# EAGLE schematic r3eflow-v1-outdated (EAGLE 9.3.0)

## Sheet 1 of 4: Main MCU
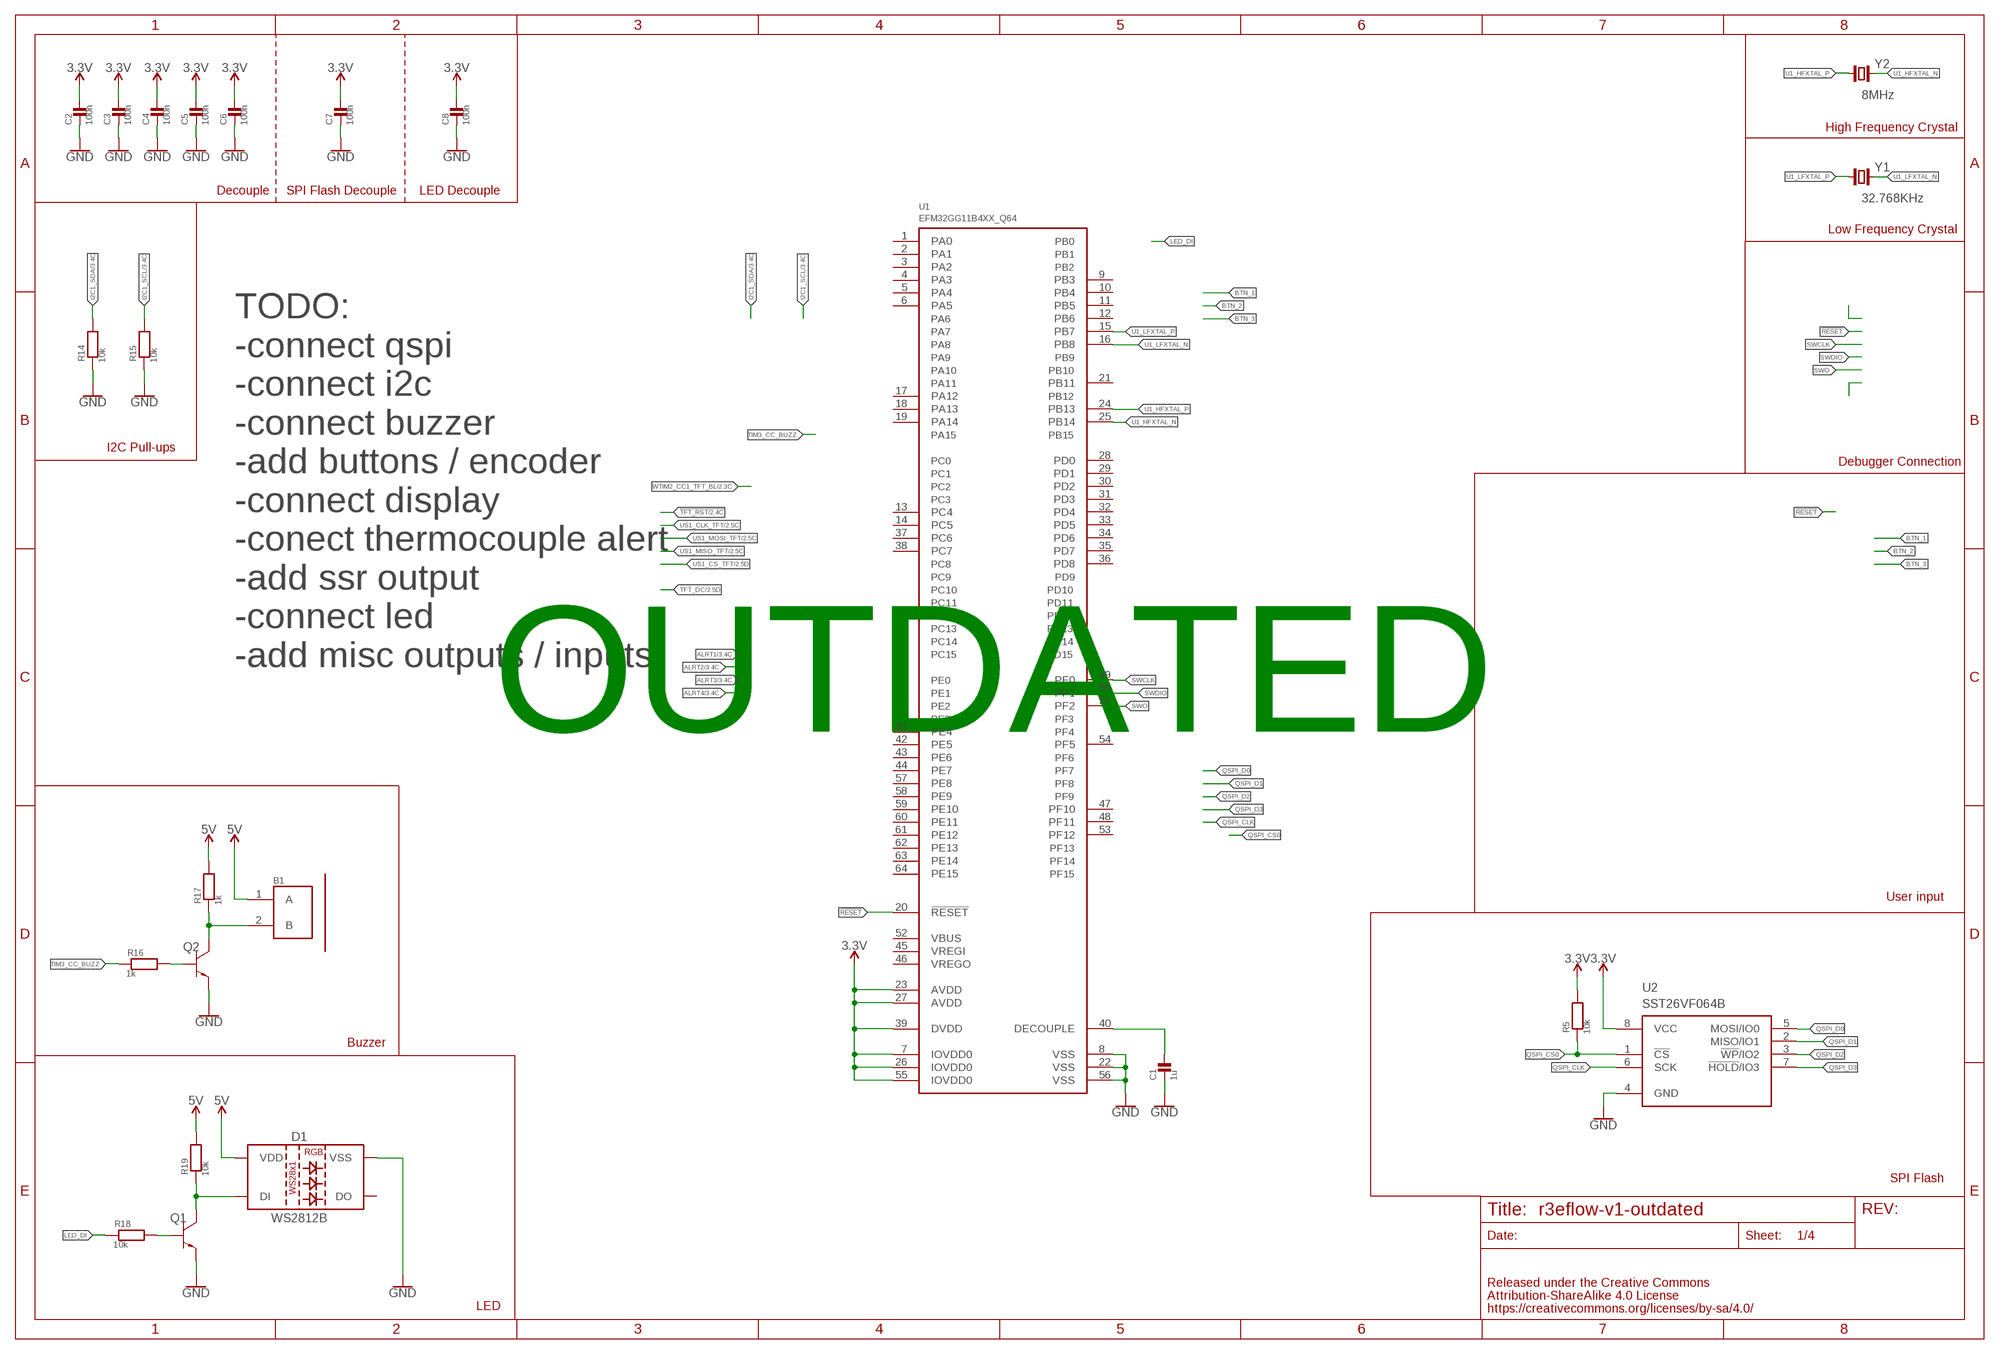
[diagram p0: schematic, sheet 1]

### Parts
B1  PKLCS1212E2400-R1  [BUZZ_PIEZO_SMD]
C1  1u  CAPACITOR_C0603  [0603_WAVE]
C2  100n  CAPACITOR_C0603  [0603_WAVE]
C3  100n  CAPACITOR_C0603  [0603_WAVE]
C4  100n  CAPACITOR_C0603  [0603_WAVE]
C5  100n  CAPACITOR_C0603  [0603_WAVE]
C6  100n  CAPACITOR_C0603  [0603_WAVE]
C7  100n  CAPACITOR_C0603  [0603_WAVE]
C8  100n  CAPACITOR_C0603  [0603_WAVE]
D1  WS2812B  [WS2812B]
Q1  BC817-40  [SOT-23-3]
Q2  BC817-40  [SOT-23-3]
R5  10k  RESISTOR0603  [0603_WAVE]
R14  10k  RESISTOR0603  [0603_WAVE]
R15  10k  RESISTOR0603  [0603_WAVE]
R16  1k  RESISTOR0603  [0603_WAVE]
R17  1k  RESISTOR0603  [0603_WAVE]
R18  10k  RESISTOR0603  [0603_WAVE]
R19  10k  RESISTOR0603  [0603_WAVE]
U1  EFM32GG11B4XX_Q64  [QFP64]
U2  SST26VF064B  [WSOIC8]
Y1  32.768KHz  CRYSTALCM200S  [CM200S]
Y2  8MHz  CRYSTALNX5032GA  [2-SMD-5X3]

### Nets
3.3V: C2.P$1 C3.P$1 C4.P$1 C5.P$1 C6.P$1 C7.P$1 C8.P$1 R5.P$2 U1.7(IOVDD0) U1.23(AVDD) U1.26(IOVDD0) U1.27(AVDD) U1.39(DVDD) U1.55(IOVDD0) U2.8(VCC) ; also sheet 2,3,4
5V: B1.1(A) D1.1(VDD) R17.P$2 R19.P$2 ; also sheet 2,4
!RESET: U1.20(!RESET)
GND: C1.P$2 C2.P$2 C3.P$2 C4.P$2 C5.P$2 C6.P$2 C7.P$2 C8.P$2 D1.3(VSS) Q1.P$2(EM2) Q2.P$2(EM2) R14.P$1 R15.P$1 U1.8(VSS) U1.22(VSS) U1.56(VSS) U2.4(GND) ; also sheet 2,3,4
I2C1_SCL: R15.P$2 ; also sheet 3
I2C1_SDA: R14.P$2 ; also sheet 3
LED_DI: R18.P$1
N$1: D1.4(DI) Q1.P$3(C03) R19.P$1
N$2: Q1.P$1(BA1) R18.P$2
N$3: C1.P$1 U1.40(DECOUPLE)
N$4: B1.2(B) Q2.P$3(C03) R17.P$1
N$5: Q2.P$1(BA1) R16.P$2
QSPI_CLK: U2.6(SCK)
QSPI_CS0: R5.P$1 U2.1(!CS!)
QSPI_D0: U2.5(MOSI/IO0)
QSPI_D1: U2.2(MISO/IO1)
QSPI_D2: U2.3(!WP!/IO2)
QSPI_D3: U2.7(!HOLD!/IO3)
SWCLK: U1.49(PF0)
SWDIO: U1.50(PF1)
SWO: U1.51(PF2)
TIM3_CC_BUZZ: R16.P$1
U1_HFXTAL_N: U1.25(PB14) Y2.2
U1_HFXTAL_P: U1.24(PB13) Y2.1
U1_LFXTAL_N: U1.16(PB8) Y1.4
U1_LFXTAL_P: U1.15(PB7) Y1.1
Unconnected: D1.2(DO) U1.1(PA0) U1.2(PA1) U1.3(PA2) U1.4(PA3) U1.5(PA4) U1.6(PA5) U1.9(PB3) U1.10(PB4) U1.11(PB5) U1.12(PB6) U1.13(PC4) U1.14(PC5) U1.17(PA12) U1.18(PA13) U1.19(PA14) U1.21(PB11) U1.28(PD0) U1.29(PD1) U1.30(PD2) U1.31(PD3) U1.32(PD4) U1.33(PD5) U1.34(PD6) U1.35(PD7) U1.36(PD8) U1.37(PC6) U1.38(PC7) U1.41(PE4) U1.42(PE5) U1.43(PE6) U1.44(PE7) U1.45(VREGI) U1.46(VREGO) U1.47(PF10) U1.48(PF11) U1.52(VBUS) U1.53(PF12) U1.54(PF5) U1.57(PE8) U1.58(PE9) U1.59(PE10) U1.60(PE11) U1.61(PE12) U1.62(PE13) U1.63(PE14) U1.64(PE15)

### Notes on the sheet
- High Frequency Crystal
- Decouple | SPI Flash Decouple | LED Decouple
- Low Frequency Crystal
- TODO:
  -connect qspi
  -connect i2c
  -connect buzzer
  -add buttons / encoder
  -connect display
  -conect thermocouple alert
  -add ssr output
  -connect led
  -add misc outputs / inputs
- I2C Pull-ups
- Debugger Connection
- OUTDATED
- User input
- Buzzer
- SPI Flash
- LED

## Sheet 2 of 4: Display
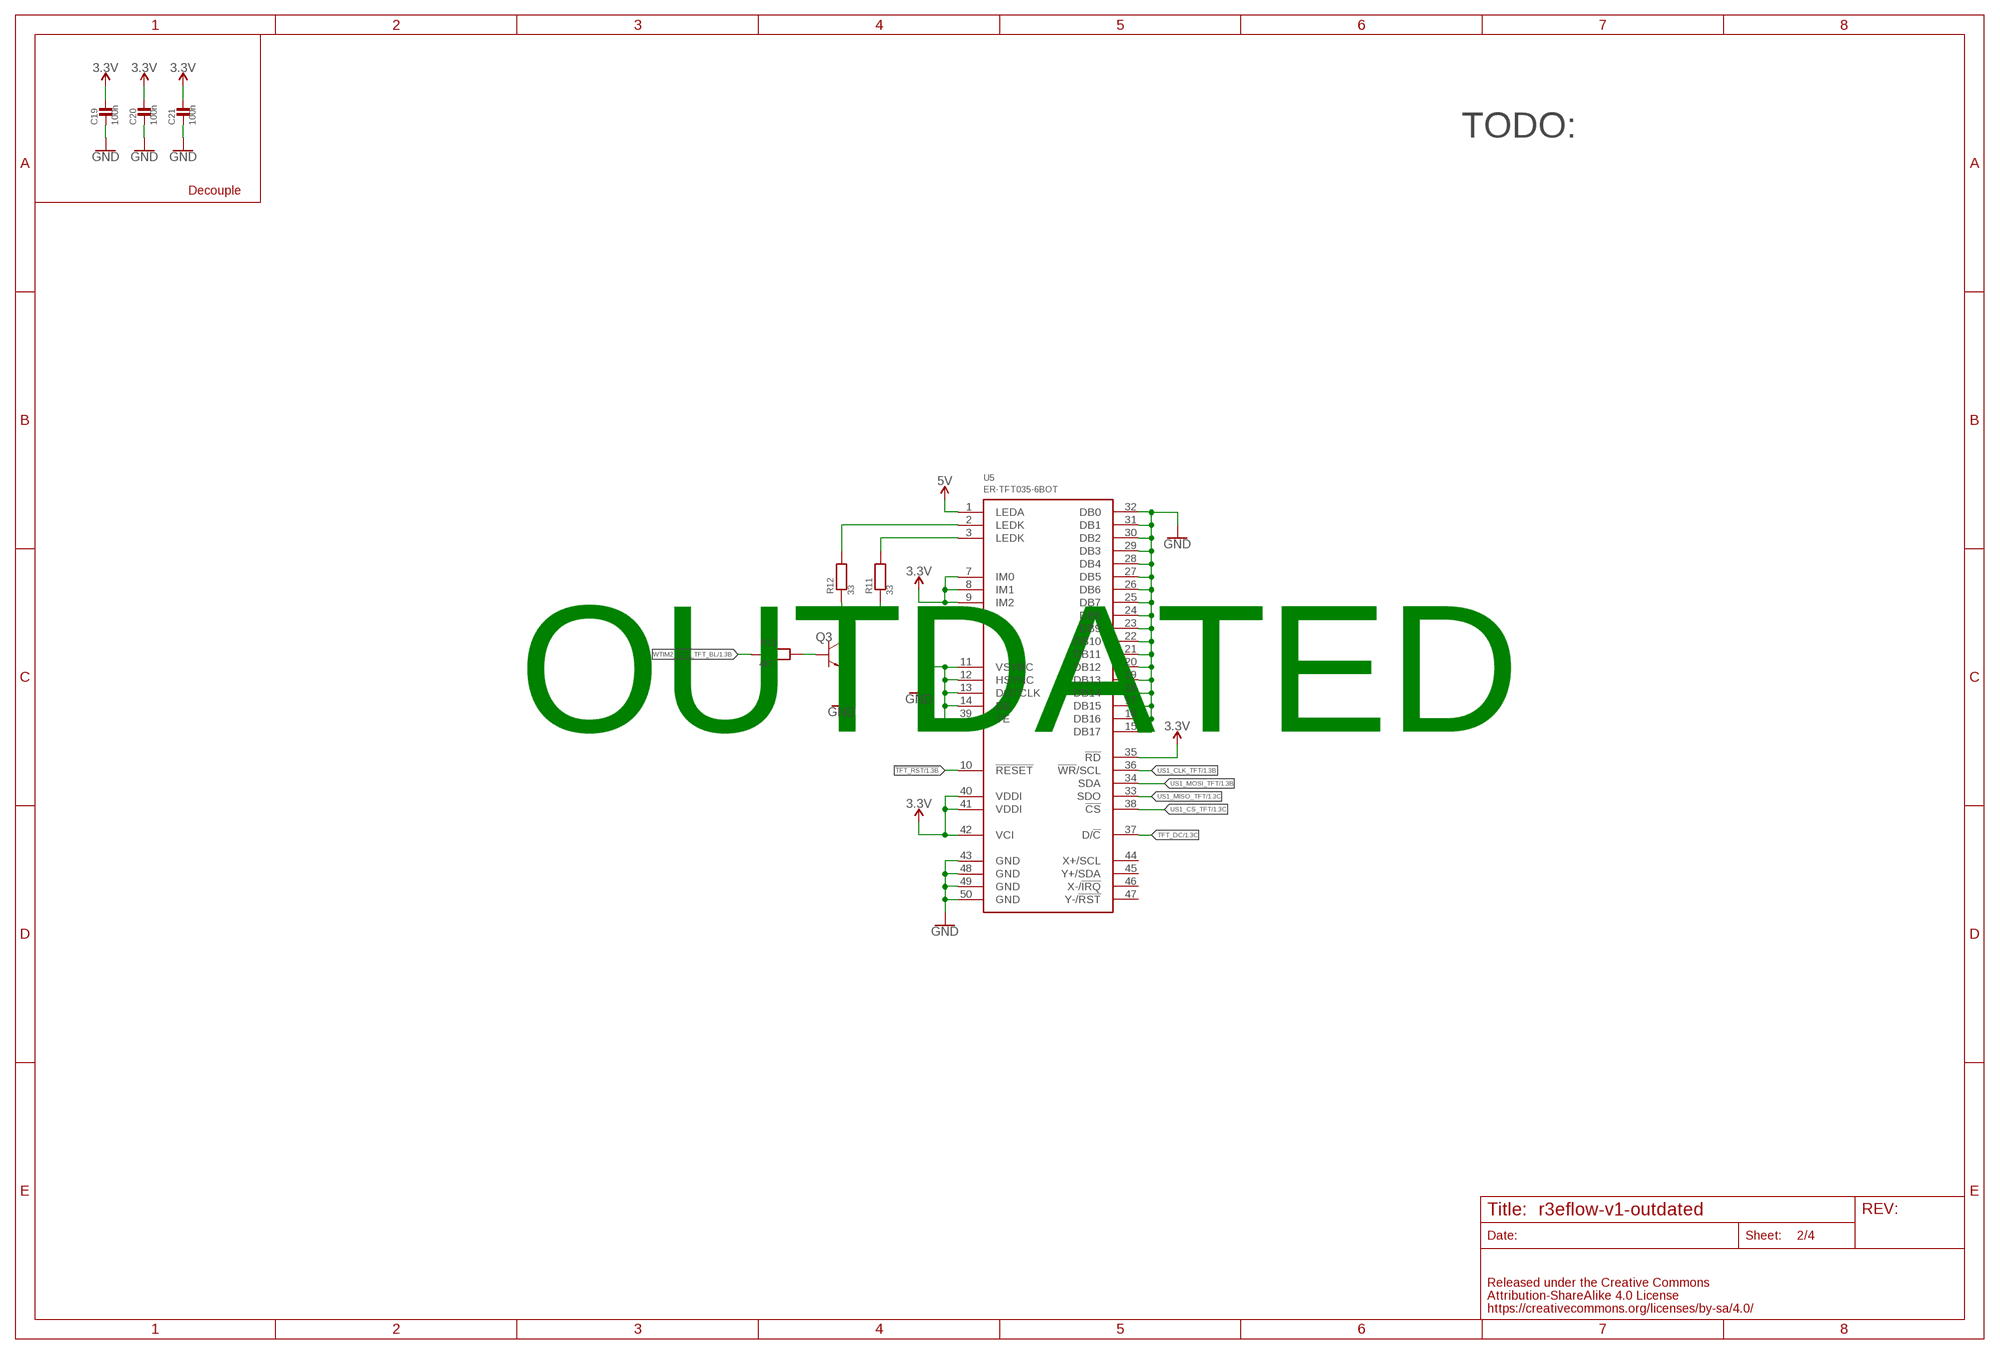
[diagram p1: schematic, sheet 2]

### Parts
C19  100n  CAPACITOR_C0603  [0603_WAVE]
C20  100n  CAPACITOR_C0603  [0603_WAVE]
C21  100n  CAPACITOR_C0603  [0603_WAVE]
Q3  BC817-40  [SOT-23-3]
R11  33  RESISTOR0603  [0603_WAVE]
R12  33  RESISTOR0603  [0603_WAVE]
R13  4k7  RESISTOR0603  [0603_WAVE]
U5  ER-TFT035-6BOT  [ZIF50-TFT_BACK]

### Nets
3.3V: C19.P$1 C20.P$1 C21.P$1 U5.7(IM0) U5.8(IM1) U5.9(IM2) U5.35(!RD) U5.40(VDDI) U5.41(VDDI) U5.42(VCI) ; also sheet 1,3,4
5V: U5.1(LEDA) ; also sheet 1,4
!TFT_RST: U5.10(!RESET) ; also sheet 1
GND: C19.P$2 C20.P$2 C21.P$2 Q3.P$2(EM2) U5.11(VSYNC) U5.12(HSYNC) U5.13(DOTCLK) U5.14(DE) U5.15(DB17) U5.16(DB16) U5.17(DB15) U5.18(DB14) U5.19(DB13) U5.20(DB12) U5.21(DB11) U5.22(DB10) U5.23(DB9) U5.24(DB8) U5.25(DB7) U5.26(DB6) U5.27(DB5) U5.28(DB4) U5.29(DB3) U5.30(DB2) U5.31(DB1) U5.32(DB0) U5.39(TE) U5.43(GND) U5.48(GND) U5.49(GND) U5.50(GND) ; also sheet 1,3,4
N$11: R12.P$2 U5.2(LEDK)
N$12: R11.P$2 U5.3(LEDK)
N$13: Q3.P$3(C03) R11.P$1 R12.P$1
N$15: Q3.P$1(BA1) R13.P$2
TFT_DC: U5.37(D/!C!) ; also sheet 1
US1_CLK_TFT: U5.36(!WR!/SCL) ; also sheet 1
US1_CS_TFT: U5.38(!CS) ; also sheet 1
US1_MISO_TFT: U5.33(SDO) ; also sheet 1
US1_MOSI_TFT: U5.34(SDA) ; also sheet 1
WTIM2_CC1_TFT_BL: R13.P$1 ; also sheet 1
Unconnected: U5.44(X+/SCL) U5.45(Y+/SDA) U5.46(X-/!IRQ!) U5.47(Y-/!RST!)

### Notes on the sheet
- TODO:
- Decouple
- OUTDATED

## Sheet 3 of 4: Temperature sensor
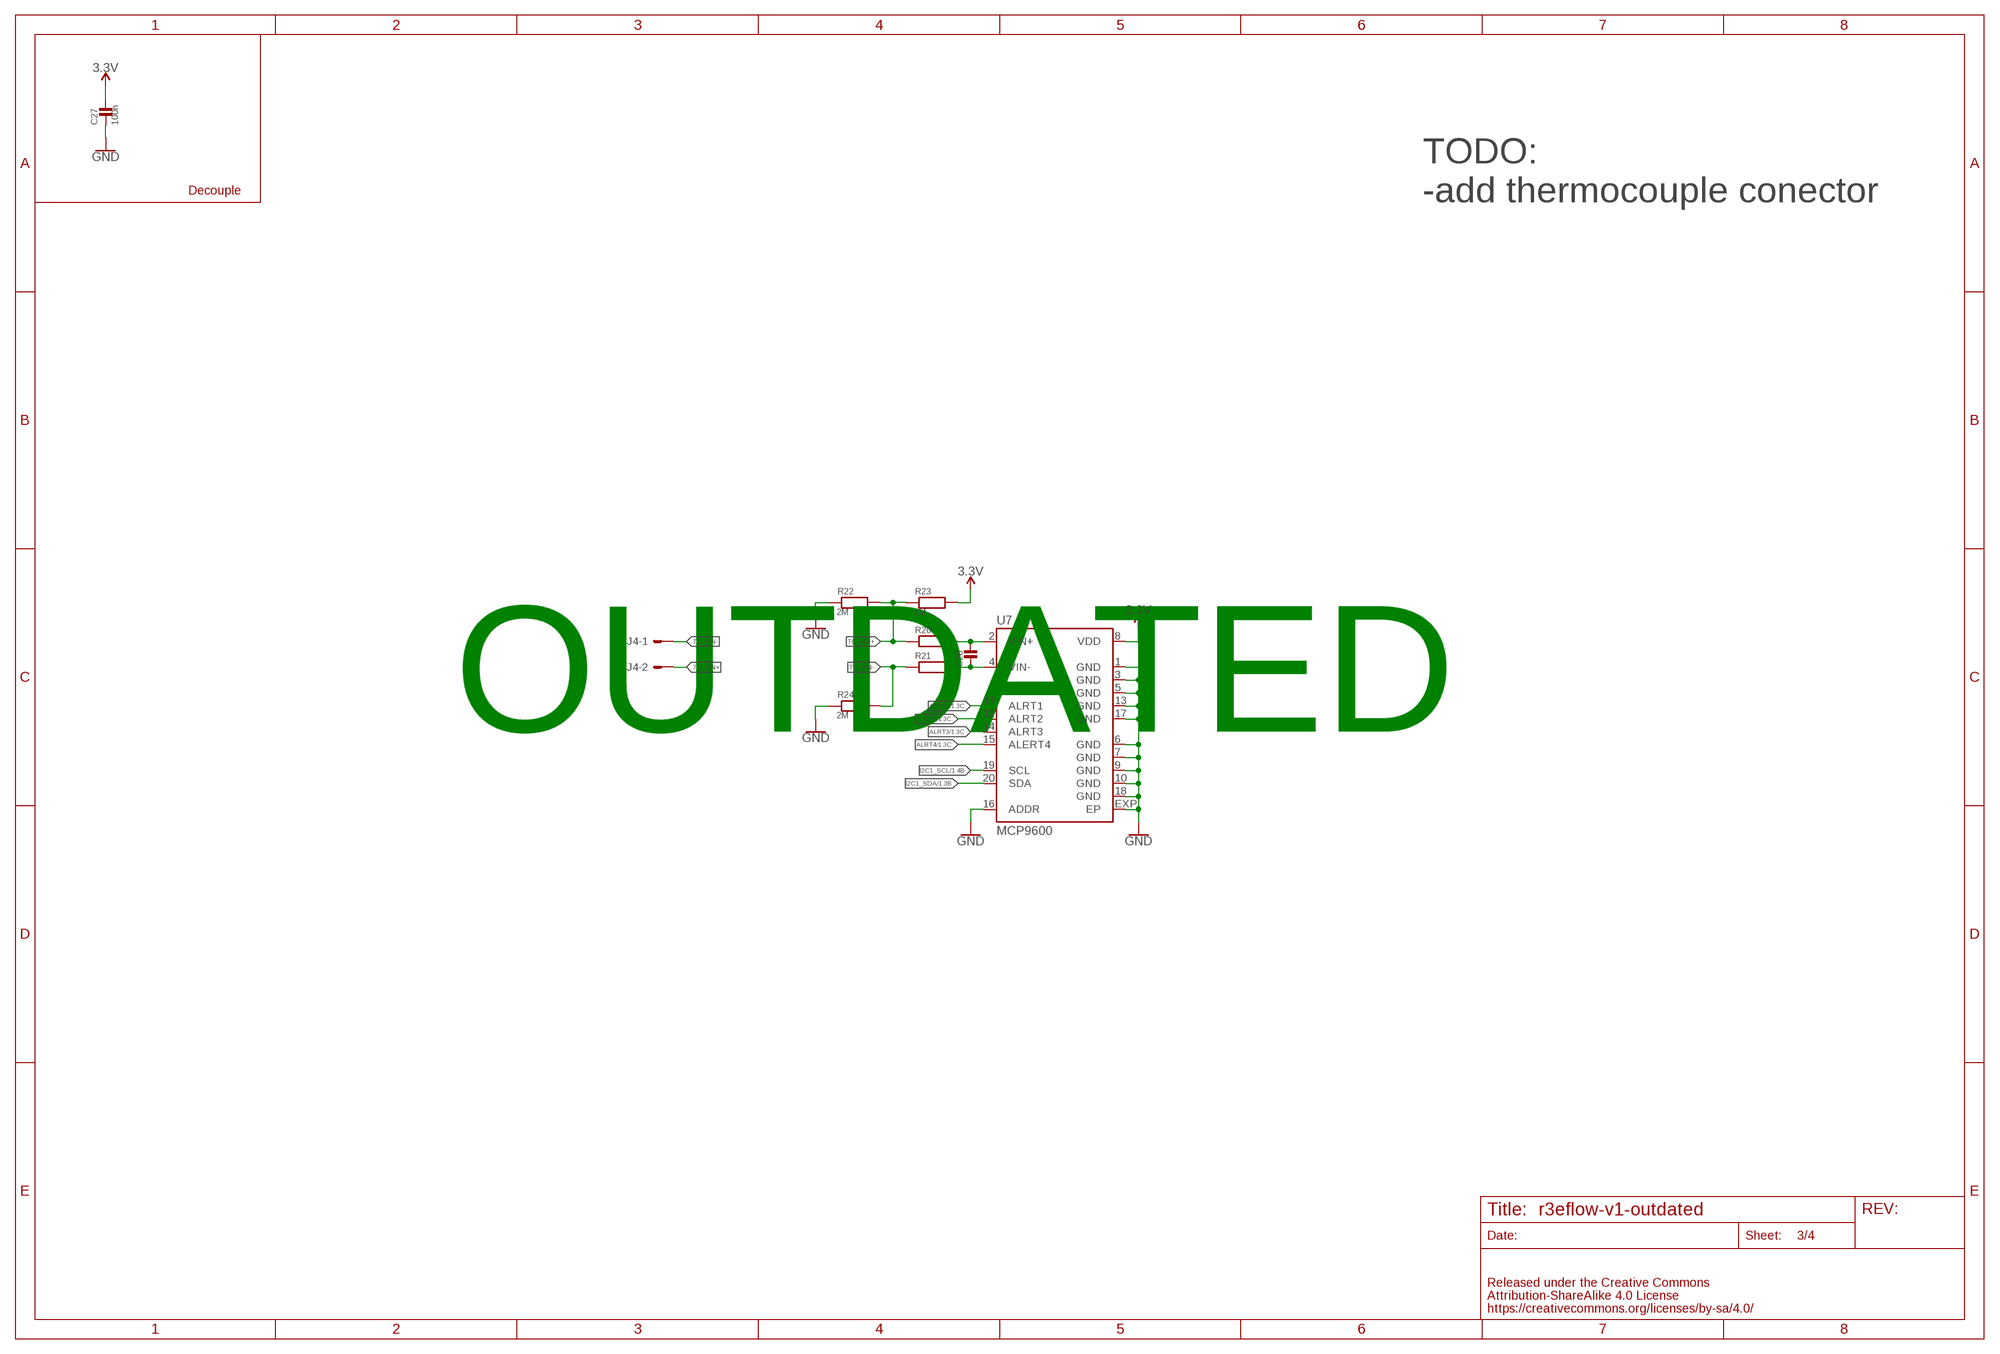
[diagram p2: schematic, sheet 3]

### Parts
C27  100n  CAPACITOR_C0603  [0603_WAVE]
C28  CAPACITOR_C0603  [0603_WAVE]
J4  1X2SPATF_1/2-3,5-IL  [SPTAF_1/2-3,5-IL]
R20  RESISTOR0603  [0603_WAVE]
R21  RESISTOR0603  [0603_WAVE]
R22  2M  RESISTOR0603  [0603_WAVE]
R23  1M  RESISTOR0603  [0603_WAVE]
R24  2M  RESISTOR0603  [0603_WAVE]
U7  MCP9600  [TQFN20-5X5]

### Nets
3.3V: C27.P$1 R23.P$2 U7.8(VDD) ; also sheet 1,2,4
ALRT1: U7.11(ALRT1) ; also sheet 1
ALRT2: U7.12(ALRT2) ; also sheet 1
ALRT3: U7.14(ALRT3) ; also sheet 1
ALRT4: U7.15(ALERT4) ; also sheet 1
GND: C27.P$2 R22.P$1 R24.P$1 U7.1(GND) U7.3(GND) U7.5(GND) U7.6(GND) U7.7(GND) U7.9(GND) U7.10(GND) U7.13(GND) U7.16(ADDR) U7.17(GND) U7.18(GND) U7.EXP(EP) ; also sheet 1,2,4
I2C1_SCL: U7.19(SCL) ; also sheet 1
I2C1_SDA: U7.20(SDA) ; also sheet 1
N$19: C28.P$1 R20.P$2 U7.2(VIN+)
N$20: C28.P$2 R21.P$2 U7.4(VIN-)
TC_VIN+: J4.P$2 J4.P$2' R20.P$1 R22.P$2 R23.P$1
TC_VIN-: J4.P$1 J4.P$1' R21.P$1 R24.P$2

### Notes on the sheet
- TODO:
  -add thermocouple conector
- Decouple
- OUTDATED

## Sheet 4 of 4: Power management
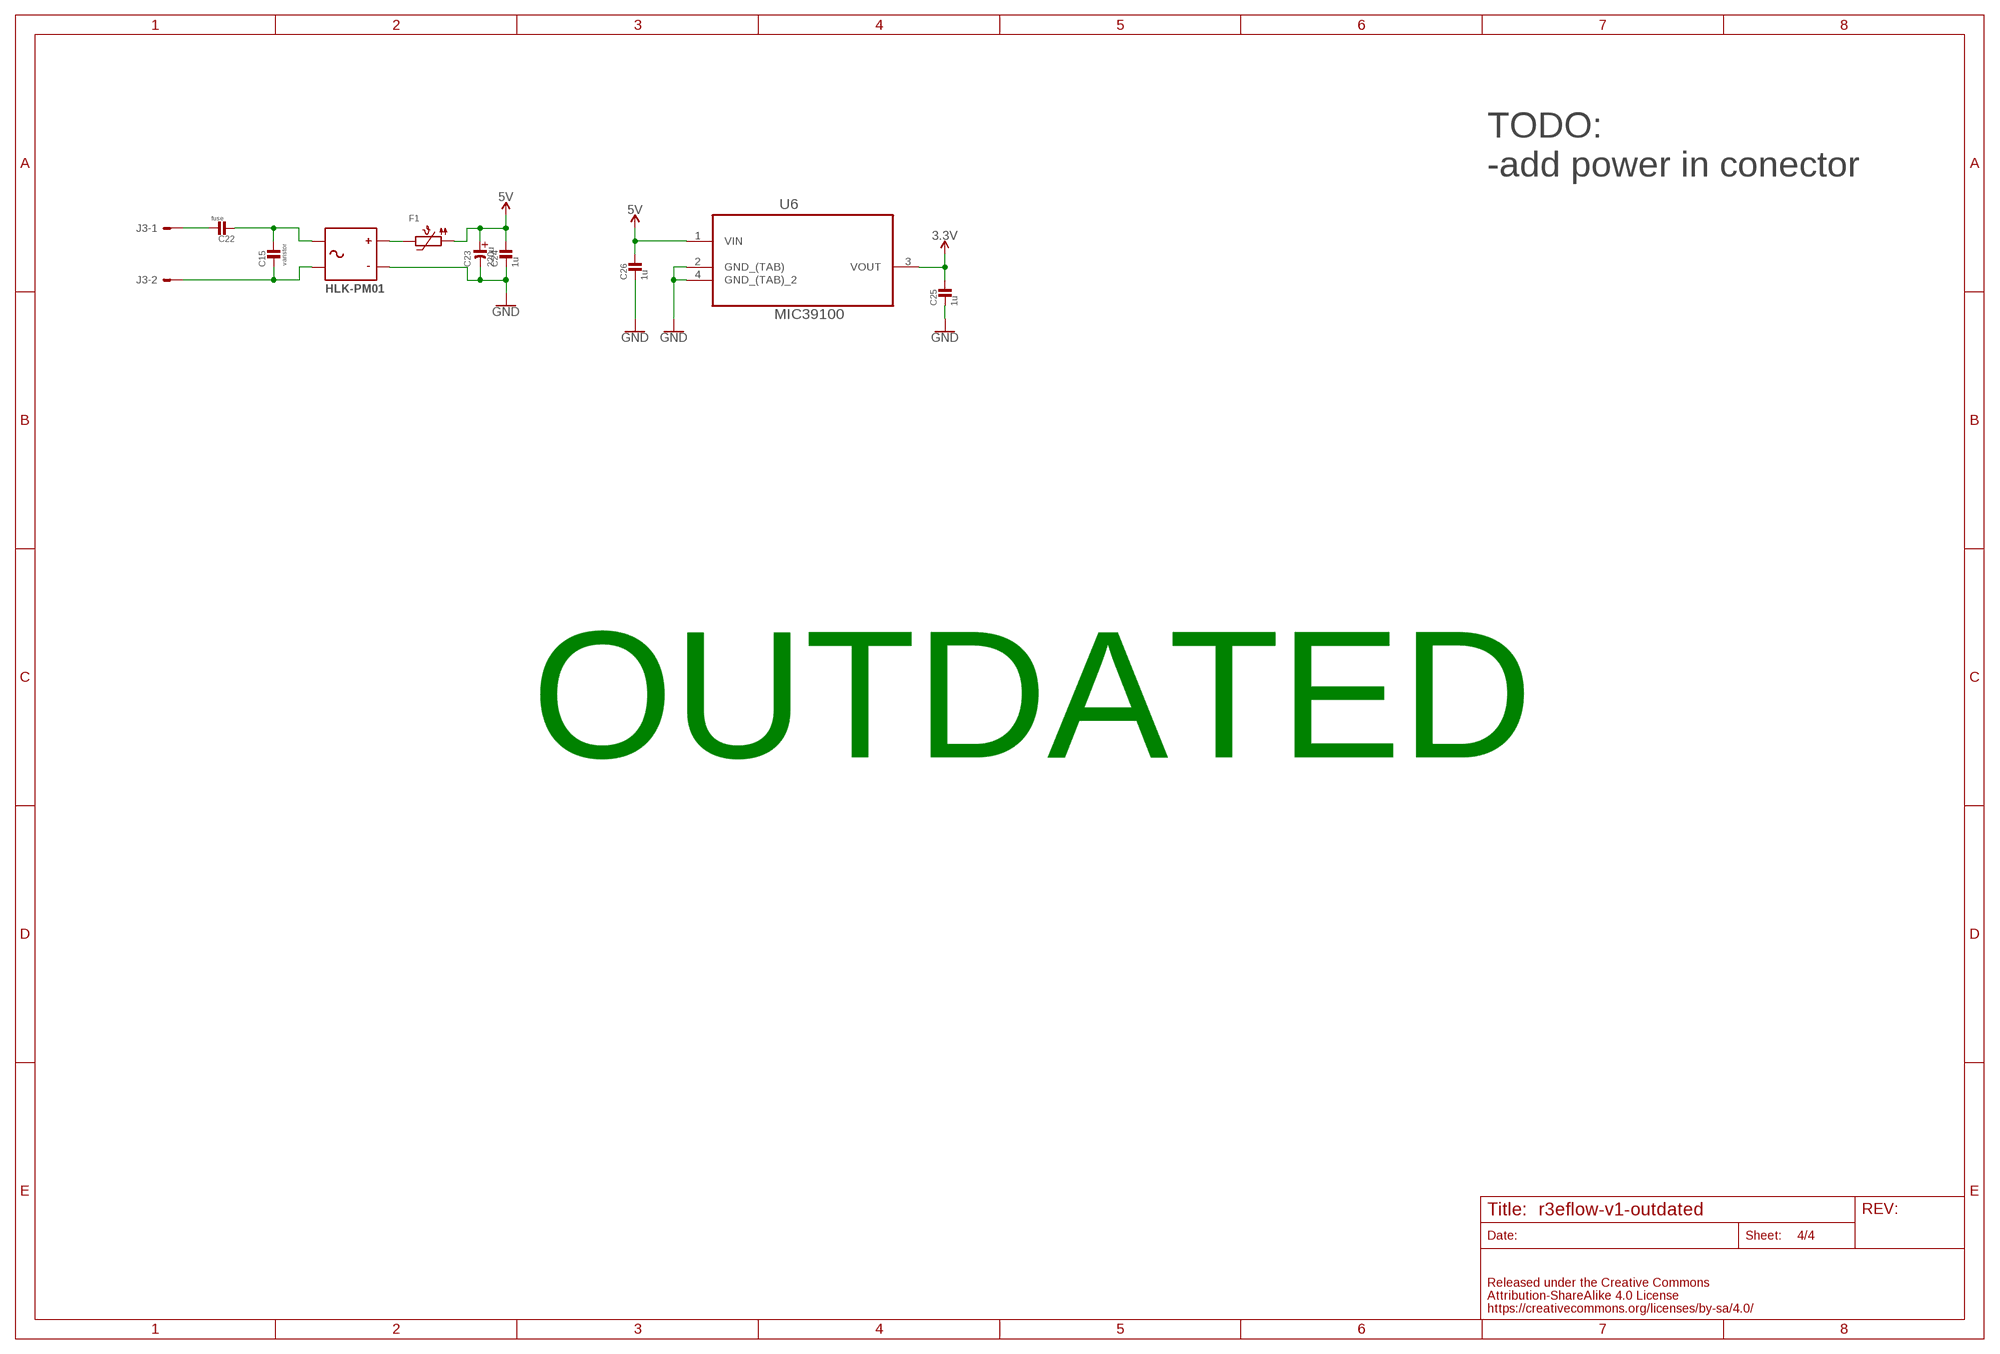
[diagram p3: schematic, sheet 4]

### Parts
C15  CAPACITOR_CTH_15MM  [15MM]
C22  CAPACITOR_CTH_15MM  [15MM]
C23  220u  CAPACITOR_EL10X10  [G]
C24  1u  CAPACITOR_C0603  [0603_WAVE]
C25  1u  CAPACITOR_C0603  [0603_WAVE]
C26  1u  CAPACITOR_C0603  [0603_WAVE]
F1  PTC1812  [PTC1812]
J3  1X2SPATF_1/2-3,5-IL  [SPTAF_1/2-3,5-IL]
U6  MIC39100  [SOT230P700X180-4N]
U$1  HLK-PM01  [HLK-PM01]

### Nets
3.3V: C25.P$1 U6.3(VOUT) ; also sheet 1,2,3
5V: C23.AN C24.P$1 C26.P$1 F1.P$1 U6.1(VIN) ; also sheet 1,2
GND: C23.CAT(CA) C24.P$2 C25.P$2 C26.P$2 U6.2(GND_(TAB)) U6.4(GND_(TAB)_2) U$1.-VO ; also sheet 1,2,3
N$14: C15.P$1 C22.P$2 U$1.AC1
N$16: C15.P$2 J3.P$2 J3.P$2' U$1.AC2
N$17: C22.P$1 J3.P$1 J3.P$1'
N$18: F1.P$2 U$1.+VO

### Notes on the sheet
- TODO:
  -add power in conector
- fuse
- varistor
- OUTDATED

## Library data of the parts
B1 = buzzer:PKLCS1212E2400-R1
C1-C8 C15 C19-C22 C24-C28 = capacitor:CAPACITOR_C: KEMET’s X7R dielectric features a 125°C maximum operating temperature and is considered temperature stable. The Electronics Components, Assemblies and Materials Association (EIA) characterizes X7R dielectric as a Class II material. Components of this classification are fixed, ceramic dielectric capacitors suited for bypass and decoupling applications or for frequency discriminating circuits where Q and stability of capacitance characteristics are not critical. X7R exhibits a predictable change in capacitance with respect to time and voltage, boasting a minimal change in capacitance with reference to ambient temperature. Capacitance change is limited to ±15% from −55°C to +125°C.
C23 = capacitor:CAPACITOR_EL
D1 = diode led:WS2812B: WS2812B SMD addressable RGB LED 5x5mm SMD LED with built-in controller IC. Color: Red/Green/Blue mC Rating: RGB: 390, 660, 180 mcd Forward Voltage: RGB: 2.0, 3.0, 3.0 V Packages:WS2812B SparkFun Products: Blynk Board - ESP8266 <https://www.sparkfun.com/products/13794>; PROD_ID: DIO-12503
F1 = fuse:PTC
J3 J4 = conector:1X2
Q1-Q3 = transistor npn bjt:BC817-40
R5 R11-R24 = resistor:RESISTOR: Resistors For new designs, use the packages preceded by an '_' character since they are more reliable: The following footprints should be used on most boards: _0402 - Standard footprint for regular board layouts _0603 - Standard footprint for regular board layouts _0805 - Standard footprint for regular board layouts _1206 - Standard footprint for regular board layouts For extremely tight-pitch boards where space is at a premium, the following 'micro-pitch' footprints can be used (smaller pads, no silkscreen outline, etc.): _0402MP - Micro-pitch footprint for very dense/compact boards _0603MP - Micro-pitch footprint for very dense/compact boards _0805MP - Micro-pitch footprint for very dense/compact boards _1206MP - Micro-pitch footprint for very dense/compact boards
U1 = mcu 32b efm32:EFM32GG11B4XX_Q64
U2 = memory flash:SST26VF064B
U5 = conector:ER-TFT035-6
U6 = regulator linear:MIC39100: IC, LDO VOLT REG, 3.3V, 0.3A,; MPN: MCP1824ST-3302E/DB; OC_FARNELL: 1578379; OC_NEWARK: 05N1293; PACKAGE: SOT-223-3; SUPPLIER: Microchip
U7 = sensor temperature:MCP9600
U$1 = power module:HLK-PM01
Y1 Y2 = crystal:CRYSTAL: Citizen CM200S & CM250S Series